# Altium schematic sheet pdb26.SchDoc
size A; SheetNumber: 1; SheetTotal: 9
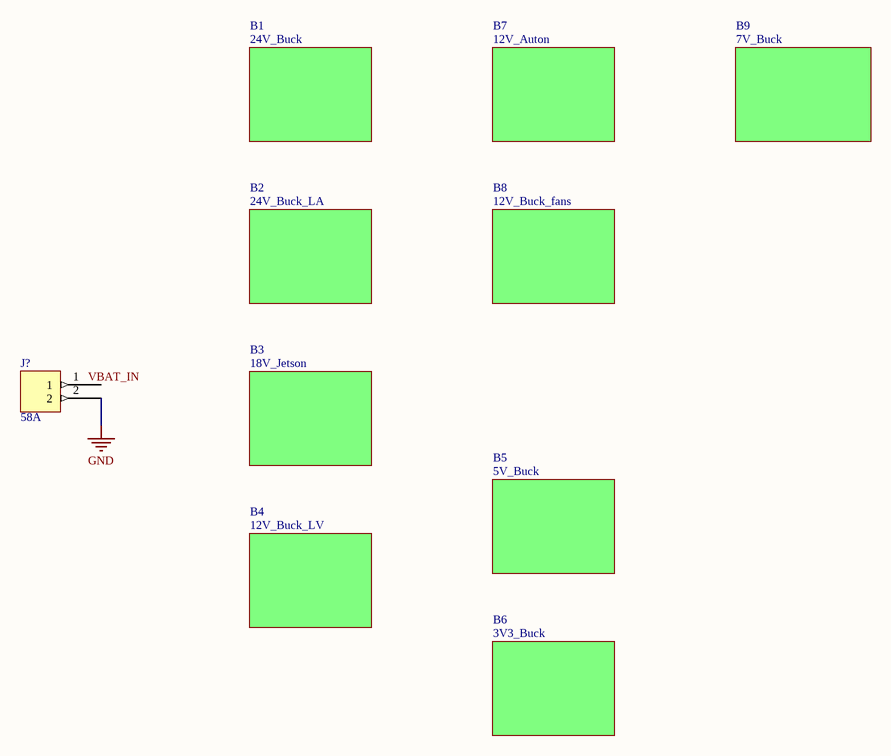
[diagram p0: pdb26.SchDoc]

## Parts
J?  Current Rating: 58A  [CONN-2PIN-0001]  (hidden comment: *691256610002)

## Sub-sheets
B1 = 24V_Buck: no entries
B2 = 24V_Buck_LA: no entries
B3 = 18V_Jetson: no entries
B4 = 12V_Buck_LV: no entries
B5 = 5V_Buck: no entries
B6 = 3V3_Buck: no entries
B7 = 12V_Auton: no entries
B8 = 12V_Buck_fans: no entries
B9 = 7V_Buck: no entries

## Nets
GND: J?.2

Not connected (* = marked no-connect by the designer): J? 1

## Notes on the sheet
- Labels drawn without touching a wire or pin: VBAT_IN

## Library data of the parts
J? = CONN-2PIN-0001: 2 Position Wire to Board Terminal Block Horizontal with Board 0.400" (10.16mm) Through Hole; Number of Inputs: 2